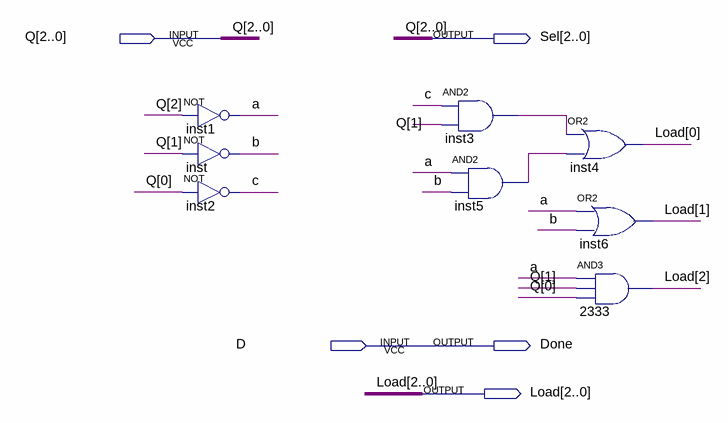
[diagram p0: schematic sheet]
// Quartus schematic Output_Logic.bdf as structural Verilog: 8 symbols, 5 pins
module Output_Logic (
  input  [2:0] Q,
  input  D,
  output [2:0] Sel,
  output Done,
  output [2:0] Load
);

  wire a, b, c, inst3_out, inst5_out;

  not inst1 (a, Q[2]);
  not inst (b, Q[1]);
  not inst2 (c, Q[0]);
  and inst3 (inst3_out, c, Q[1]);
  and inst5 (inst5_out, a, b);
  or inst4 (Load[0], inst3_out, inst5_out);
  or inst6 (Load[1], a, b);
  and u_2333 (Load[2], a, Q[1], Q[0]);

  assign Done = D;
  assign Sel = Q;
endmodule
